# EAGLE design 3-chip H-bridge circuit (EAGLE 5.12)
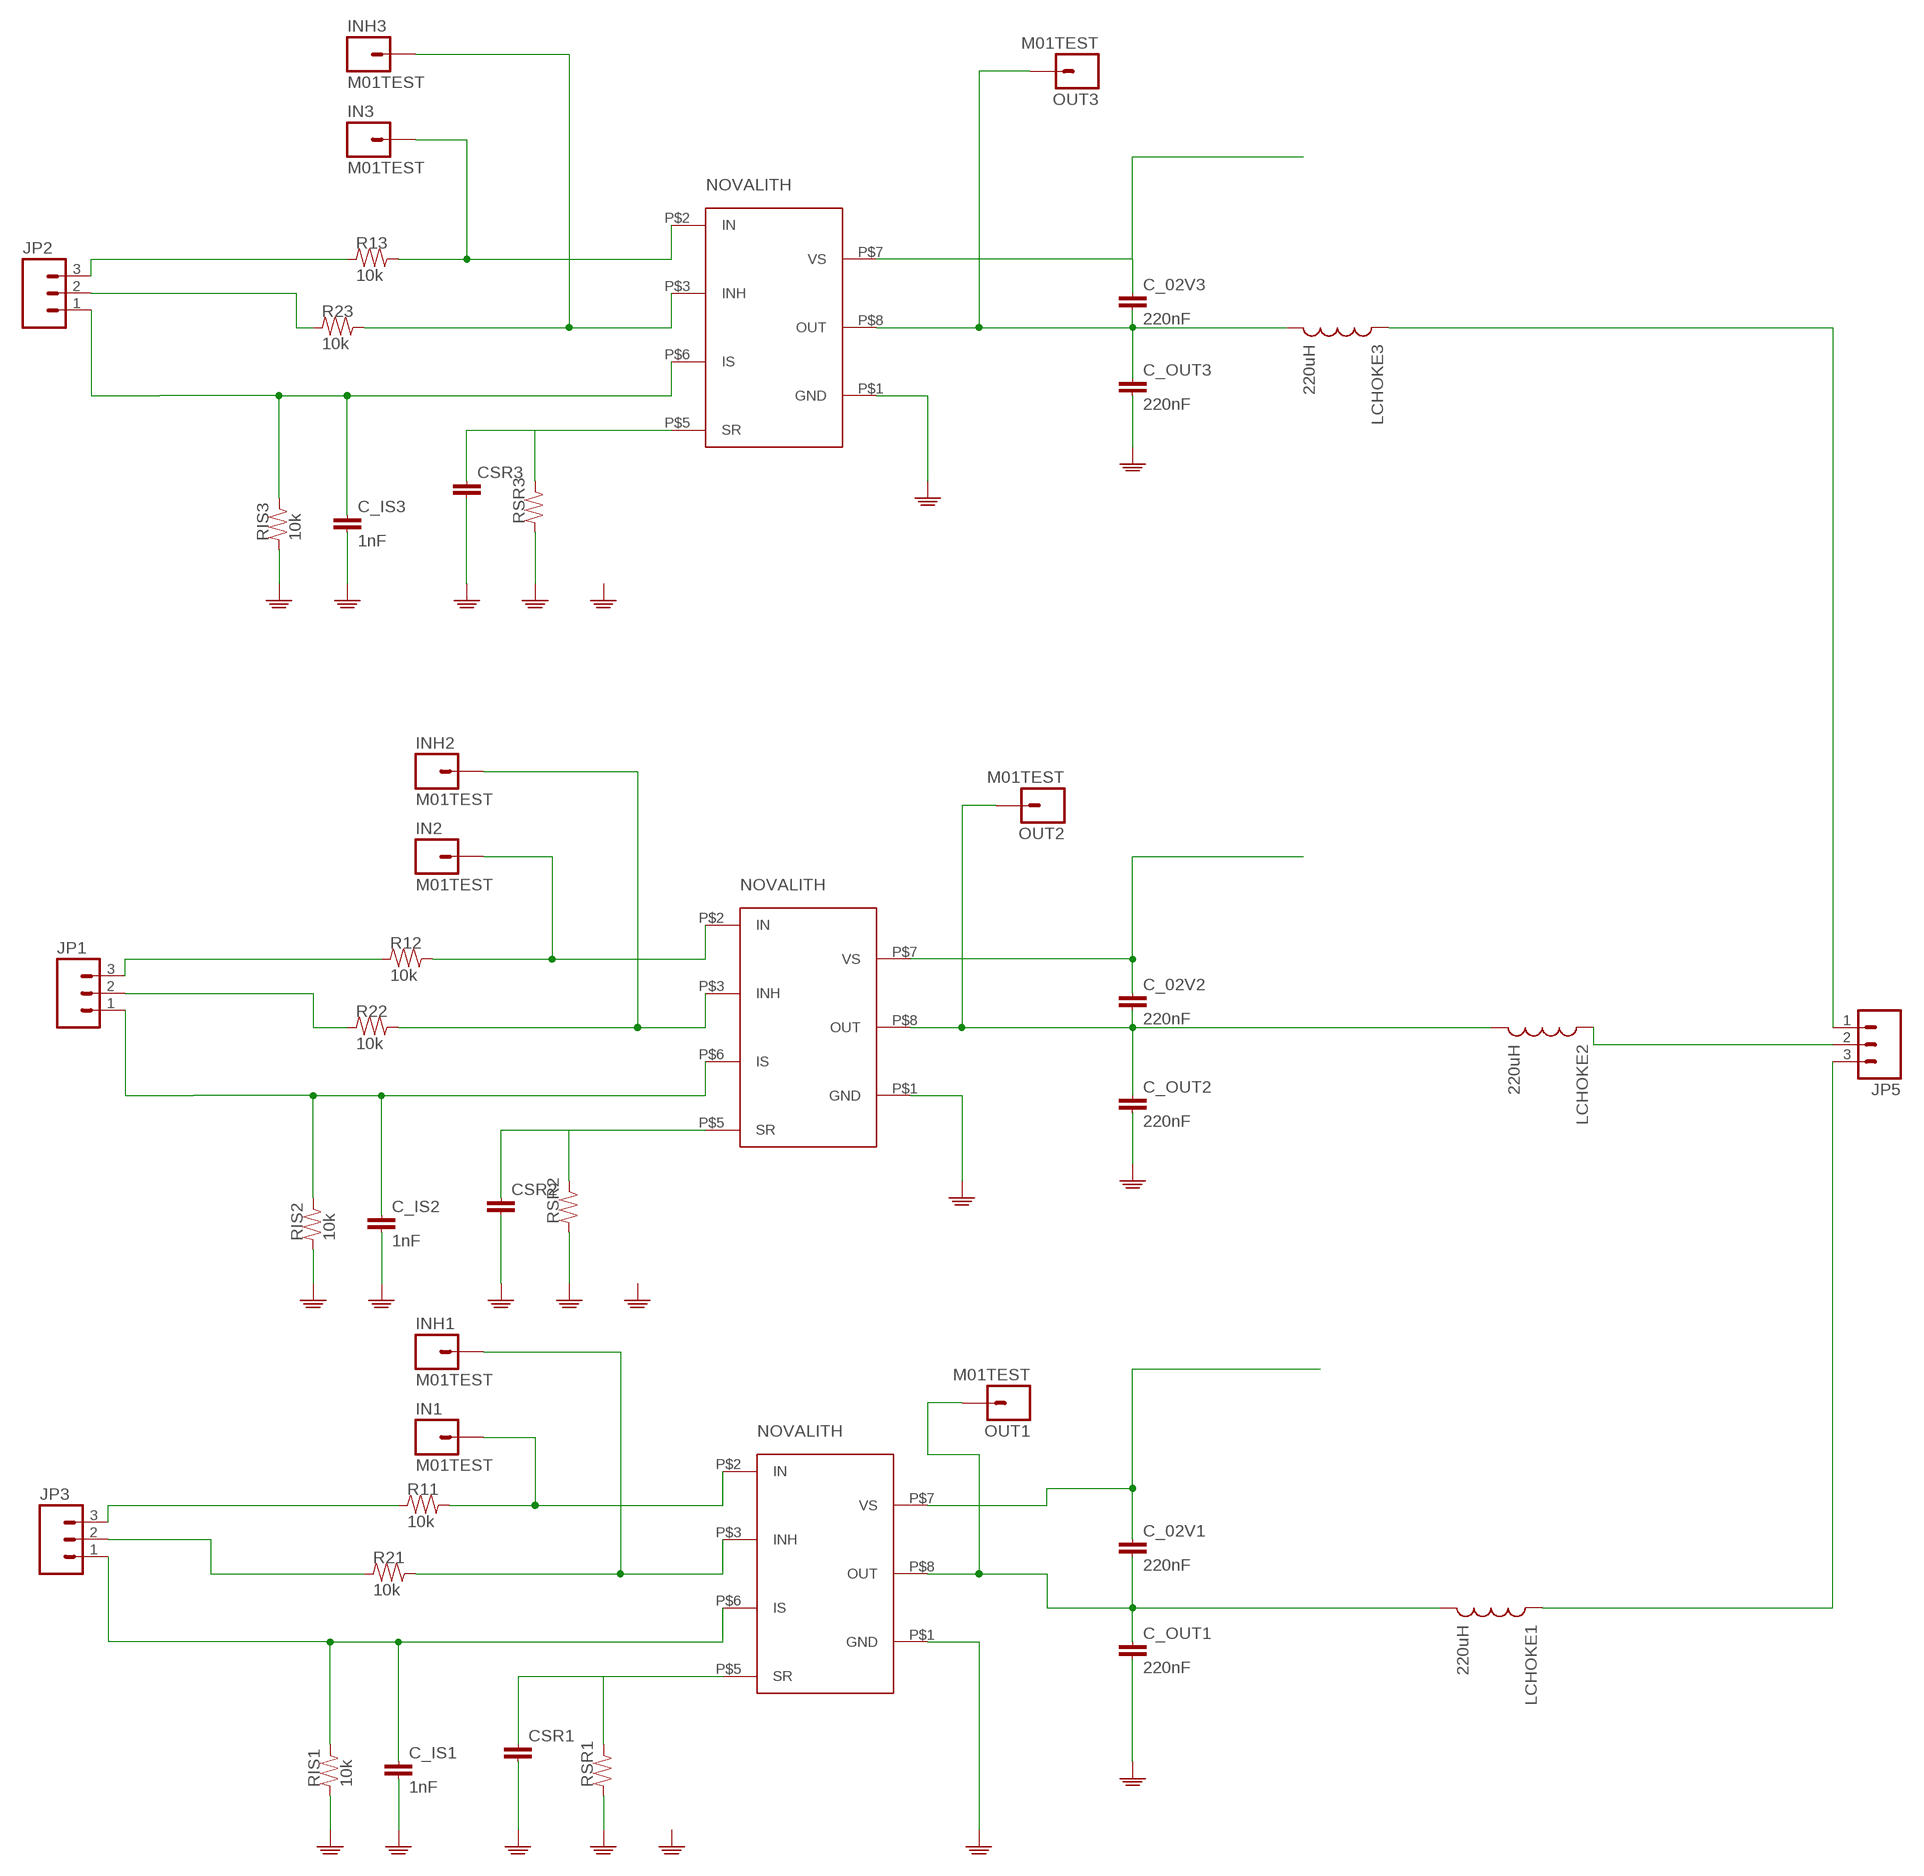
[diagram p0: schematic, sheet 1, part 1 of 2]
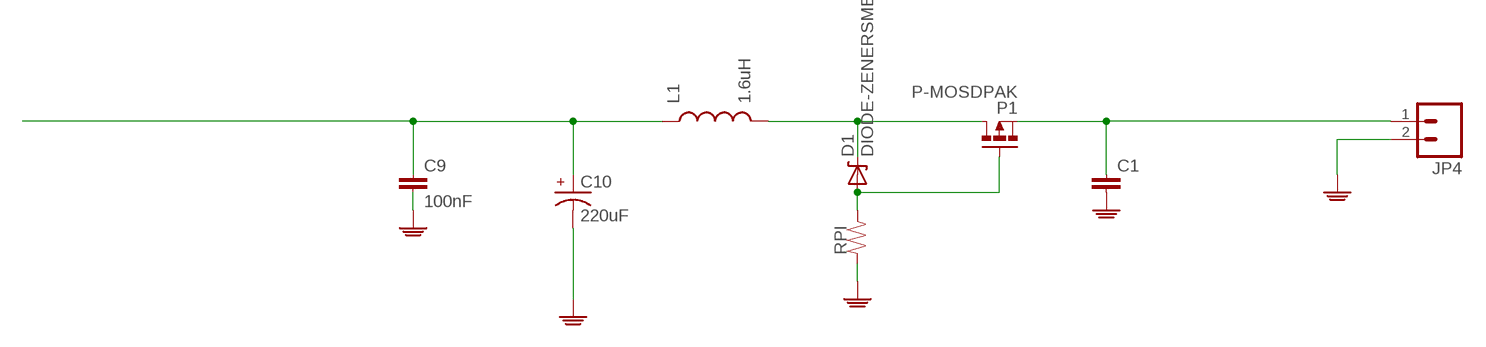
[diagram p1: schematic, sheet 1, part 2 of 2]

## Parts
C1  CAP5MM  [CAP-PTH-5MM]
C9  100nF  CAP1206  [1206]
C10  220uF  CAP-POLPCV10  [PCV10]
C_02V1  220nF  CAP0603  [0603]
C_02V2  220nF  CAP0603  [0603]
C_02V3  220nF  CAP0603  [0603]
C_IS1  1nF  CAP0603  [0603]
C_IS2  1nF  CAP0603  [0603]
C_IS3  1nF  CAP0603  [0603]
C_OUT1  220nF  CAP0603  [0603]
C_OUT2  220nF  CAP0603  [0603]
C_OUT3  220nF  CAP0603  [0603]
CSR1  CAP0603  [0603]
CSR2  CAP0603  [0603]
CSR3  CAP0603  [0603]
D1  DIODE-ZENERSMB  [SMB-DIODE]
IN1  M01TEST  [1X01_TEST]
IN2  M01TEST  [1X01_TEST]
IN3  M01TEST  [1X01_TEST]
INH1  M01TEST  [1X01_TEST]
INH2  M01TEST  [1X01_TEST]
INH3  M01TEST  [1X01_TEST]
JP1  M03PH-TH  [JST-3-PH-TH]
JP2  M03PH-TH  [JST-3-PH-TH]
JP3  M03PH-TH  [JST-3-PH-TH]
JP4  M02MINIFITJR  [MOLEX-2-MINIFITJR-RA]
JP5  M03MINIFITJR  [MOLEX-3-MINIFITJR-RA]
L1  1.6uH  INDUCTOR  [INDETQ-P]
LCHOKE1  220uH  INDUCTOR2200LL-820  [2200LL-820]
LCHOKE2  220uH  INDUCTOR2200LL-820  [2200LL-820]
LCHOKE3  220uH  INDUCTOR2200LL-820  [2200LL-820]
OUT1  M01TEST  [1X01_TEST]
OUT2  M01TEST  [1X01_TEST]
OUT3  M01TEST  [1X01_TEST]
P1  P-MOSDPAK  [DPAK]
R11  10k  R0603  [0603]
R12  10k  R0603  [0603]
R13  10k  R0603  [0603]
R21  10k  R0603  [0603]
R22  10k  R0603  [0603]
R23  10k  R0603  [0603]
RIS1  10k  R0603  [0603]
RIS2  10k  R0603  [0603]
RIS3  10k  R0603  [0603]
RPI  R0603  [0603]
RSR1  R0603  [0603]
RSR2  R0603  [0603]
RSR3  R0603  [0603]
U$2  NOVALITHIC2  [PG-TO263-7-1]
U$3  NOVALITHIC2  [PG-TO263-7-1]
U$4  NOVALITHIC2  [PG-TO263-7-1]

## Nets
GND: C1.2 C9.2 C10.- C_IS1.2 C_IS2.2 C_IS3.2 C_OUT1.2 C_OUT2.2 C_OUT3.2 CSR1.2 CSR2.2 CSR3.2 JP4.2 RIS1.1 RIS2.1 RIS3.1 RPI.1 RSR1.1 RSR2.1 RSR3.1 U$2.P$1(GND) U$3.P$1(GND) U$4.P$1(GND)
N$1: IN1.1 R11.2 U$2.P$2(IN)
N$2: C_IS1.1 JP3.1 RIS1.2 U$2.P$6(IS)
N$3: JP5.2 LCHOKE2.1
N$4: INH1.1 R21.2 U$2.P$3(INH)
N$6: IN3.1 R13.2 U$3.P$2(IN)
N$7: C_02V2.2 C_OUT2.1 LCHOKE2.2 OUT2.1 U$4.P$8(OUT)
N$8: JP3.2 R21.1
N$9: C_IS3.1 JP2.1 RIS3.2 U$3.P$6(IS)
N$10: C_02V1.2 C_OUT1.1 LCHOKE1.2 OUT1.1 U$2.P$8(OUT)
N$11: D1.C L1.P$4 P1.D
N$12: JP3.3 R11.1
N$14: INH3.1 R23.2 U$3.P$3(INH)
N$15: IN2.1 R12.2 U$4.P$2(IN)
N$16: C_IS2.1 JP1.1 RIS2.2 U$4.P$6(IS)
N$18: INH2.1 R22.2 U$4.P$3(INH)
N$19: JP1.2 R22.1
N$20: D1.A P1.G RPI.2
N$21: JP1.3 R12.1
N$22: C_02V3.2 C_OUT3.1 LCHOKE3.2 OUT3.1 U$3.P$8(OUT)
N$23: C1.1 JP4.1 P1.S
N$24: JP2.2 R23.1
N$25: JP2.3 R13.1
N$26: JP5.3 LCHOKE1.1
N$28: JP5.1 LCHOKE3.1
N$29: CSR1.1 RSR1.2 U$2.P$5(SR)
N$30: CSR3.1 RSR3.2 U$3.P$5(SR)
N$31: CSR2.1 RSR2.2 U$4.P$5(SR)
VS: C9.1 C10.+ C_02V1.1 C_02V2.1 C_02V3.1 L1.P$3 U$2.P$7(VS) U$3.P$7(VS)
Unconnected: U$4.P$7(VS)

## Library data of the parts
C1 = GibbotV5SLAM:CAP: Capacitor Standard 0603 ceramic capacitor, and 0.1" leaded capacitor.
C9 C_02V1-C_02V3 C_IS1-C_IS3 C_OUT1-C_OUT3 CSR1-CSR3 = GibbotV5 (1):CAP: Capacitor Standard 0603 ceramic capacitor, and 0.1" leaded capacitor.
C10 = GibbotV5SLAM:CAP-POL: CAPACITOR, American symbol
D1 = GibbotV5 (1):DIODE-ZENER: Zener Diode Production Part - 8199 3.4V Zener Voltage
IN1-IN3 INH1-INH3 OUT1-OUT3 = GibbotV5 (1):M01: Header 1 Standard 1-pin 0.1" header. Use with straight break away headers (SKU : PRT-00116), right angle break away headers (PRT-00553), swiss pins (PRT-00743), machine pins (PRT-00117), and female headers (PRT-00115).
JP1-JP3 JP5 = GibbotV5 (1):M03: Header 3 Standard 3-pin 0.1" header. Use with straight break away headers (SKU : PRT-00116), right angle break away headers (PRT-00553), swiss pins (PRT-00743), machine pins (PRT-00117), and female headers (PRT-00115). Molex polarized connector foot print use with SKU : PRT-08232 with associated crimp pins and housings.
JP4 = GibbotV5 (1):M02: Header 2 Standard 2-pin 0.1" header. Use with straight break away headers (SKU : PRT-00116), right angle break away headers (PRT-00553), swiss pins (PRT-00743), machine pins (PRT-00117), and female headers (PRT-00115). Molex polarized connector foot print use with SKU : PRT-08233 with associated crimp pins and housings.
L1 = GibbotV5SLAM:INDUCTOR: Inductors Basic Inductor/Choke - 0603 and 1206. Footprints are not proven and vary greatly between part numbers.
LCHOKE1-LCHOKE3 = GibbotV5 (1):INDUCTOR: Inductors Basic Inductor/Choke - 0603 and 1206. Footprints are not proven and vary greatly between part numbers.
P1 = GibbotV5SLAM:P-MOSDPAK
R11-R13 R21-R23 RIS1-RIS3 RPI RSR1-RSR3 = GibbotV5 (1):R: RESISTOR, American symbol
U$2-U$4 = SLAM:NOVALITHIC

## Board
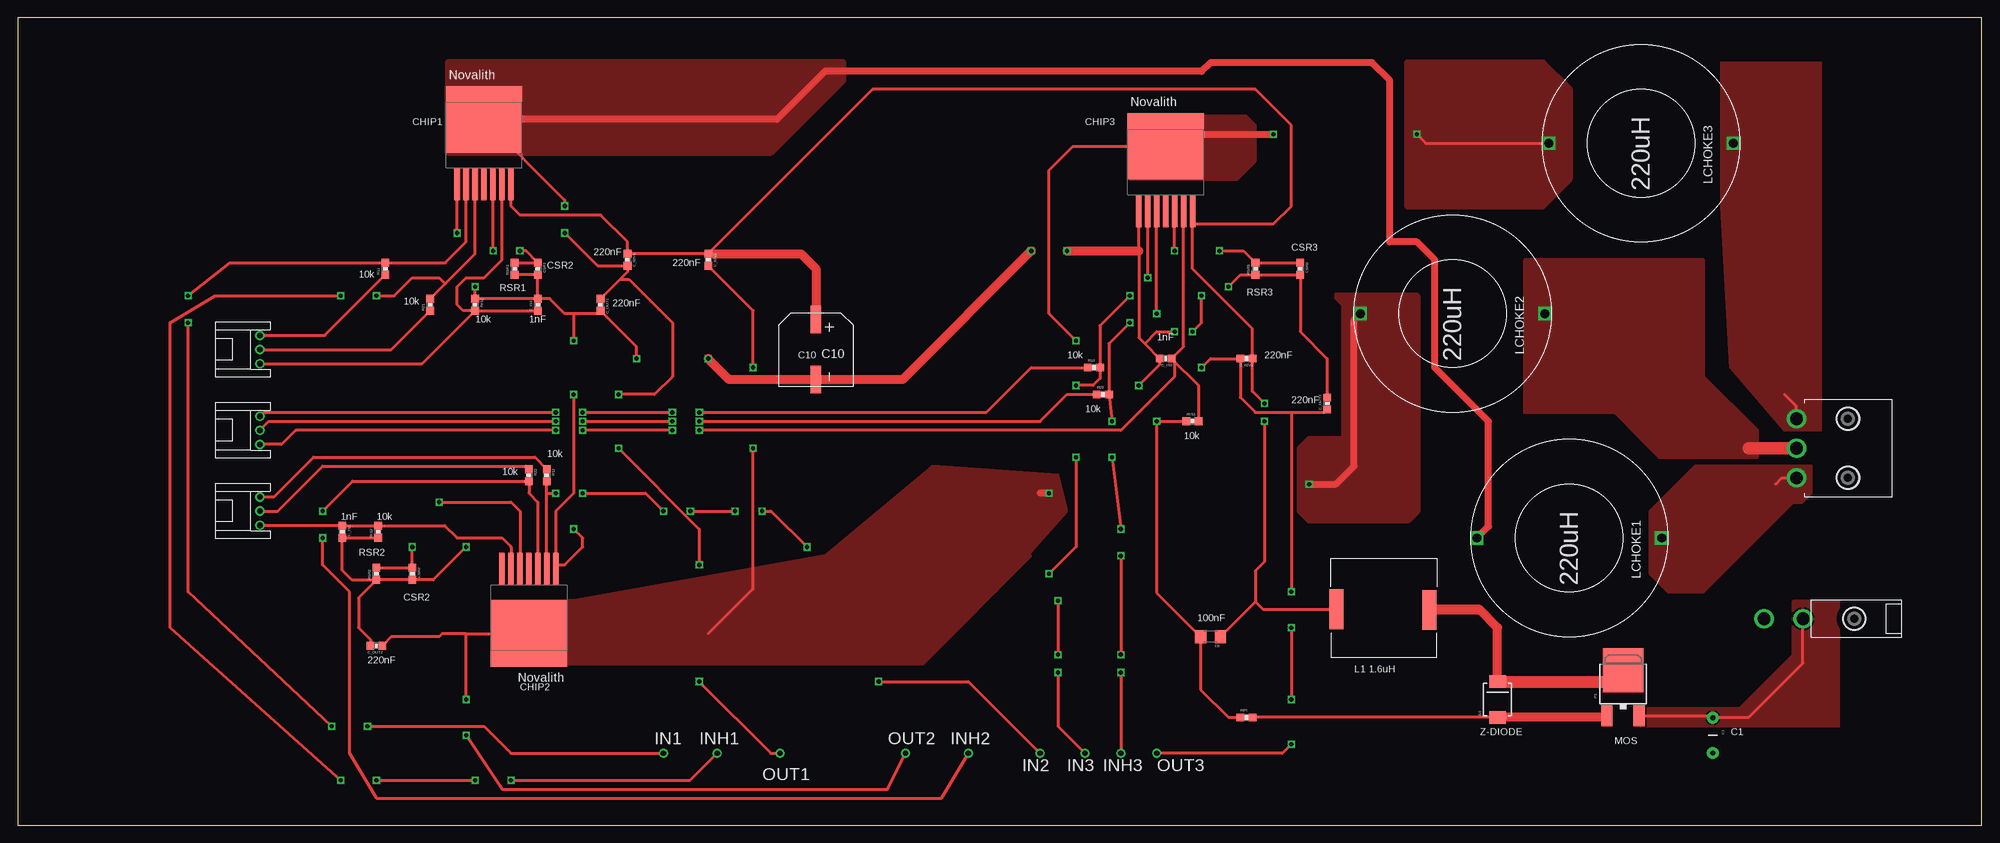
[diagram p2: board, top side]
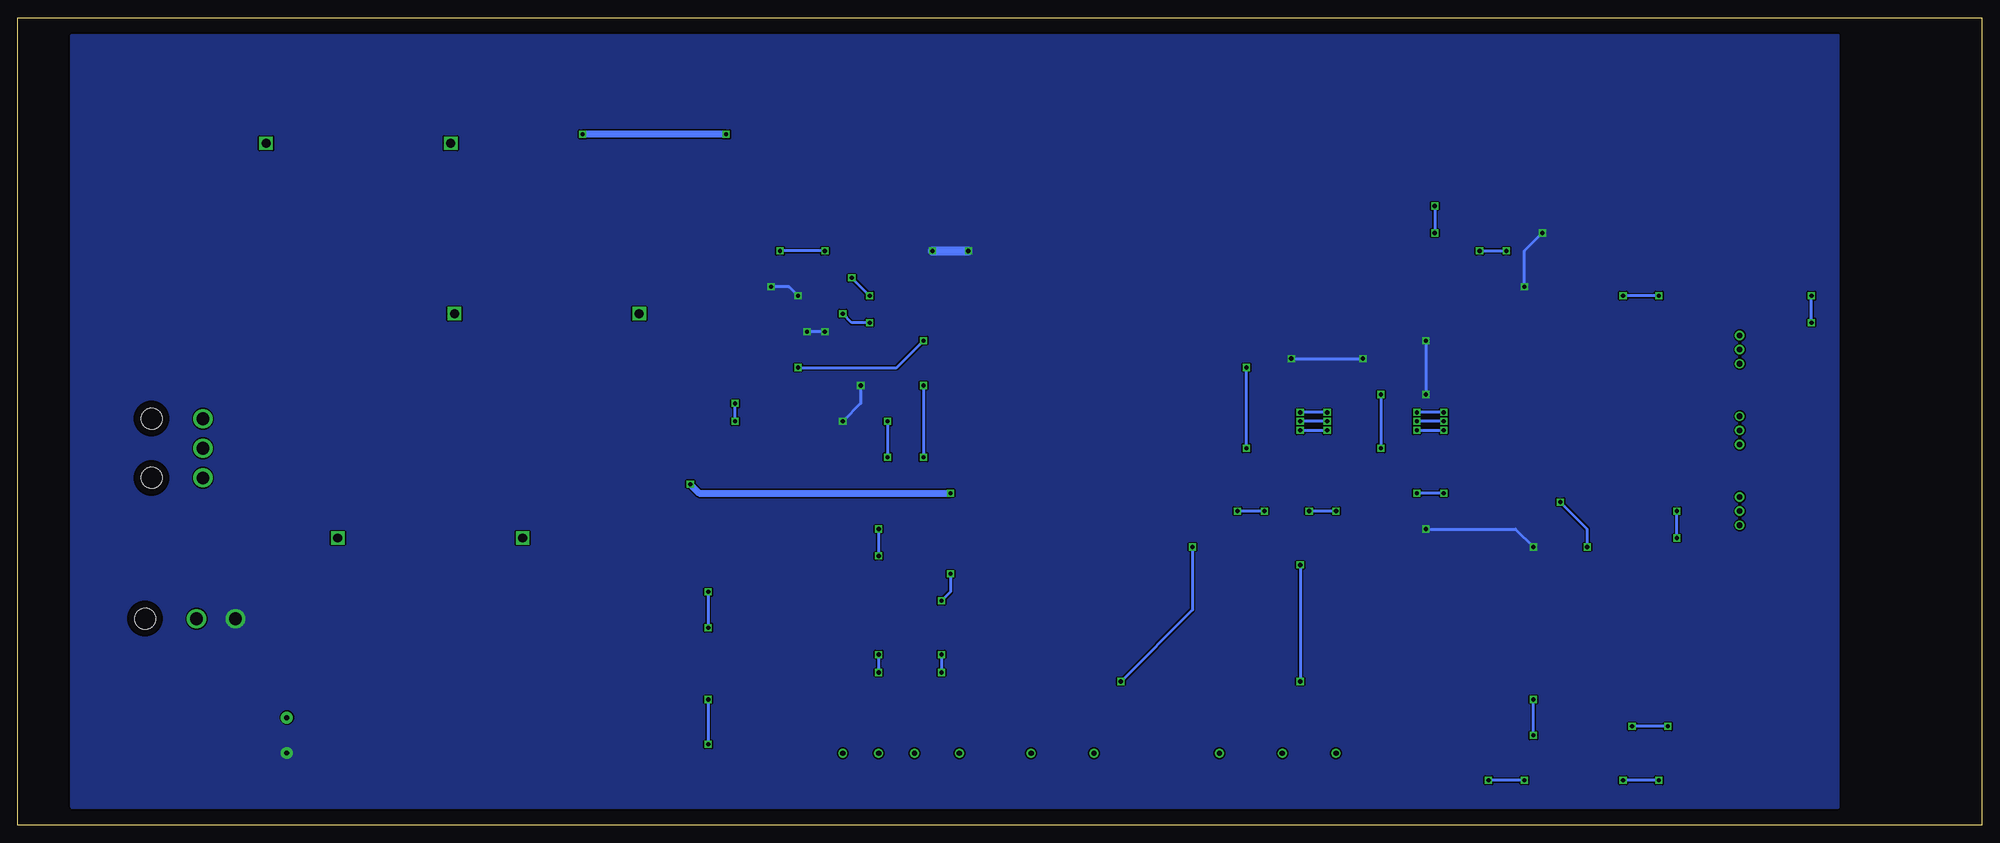
[diagram p3: board, bottom side, seen from below]

Size 278.13 x 114.3 mm. Coordinates in mm from the lower left corner, seen from the top.
Outline: 0,0 278.13,0 278.13,114.3 0,114.3 0,0
Copper layers (1*16): Top 0.035mm / dielectric 1.5mm / Bottom 0.035mm
Design rules "default": minimum track width 10mil, minimum drill 24mil, track to track 8mil, track to pad 8mil, pad to pad 8mil, via to via 8mil, smd to smd 8mil, copper to edge 40mil, drill to drill 8mil, minimum pad ring 10mil, minimum via ring 8mil, stop-mask expansion 4mil, vias tented up to drill 0mil, thermal gap 10mil

### Footprints (pad centres in the part's own frame; a part is rotated, then mirrored left to right if it is on the bottom)
CAP-PTH-5MM = drill 0.7 pad 1.651 round: 1 -2.5,0; 2 2.5,0
1206 = smd 1.6 x 1.8: 1 -1.4,0; 2 1.4,0
PCV10 = smd 1.5 x 3.9: + 0,-4.25; - 0,4.25
0603 = smd 1.1 x 1.1: 1 -0.85,0; 2 0.85,0
SMB-DIODE = smd 1.75 x 2.3: A -2.54,0; C 2.54,0
1X01_TEST = drill 0.762 round: 1 0,0
JST-3-PH-TH = drill 0.8 round: 1 -2,-6.35; 2 0,-6.35; 3 2,-6.35
MOLEX-2-MINIFITJR-RA = drill 1.803 round: 1 0,13.894; 2 0,19.406 | hole 3: 0,6.604
MOLEX-3-MINIFITJR-RA = drill 1.803 round: 1 4.191,13.538; 2 0,13.538; 3 -4.191,13.538 | hole 3: -4.204,6.248; 4.204,6.248
INDETQ-P = smd 2 x 5.6: P$3 -1.215,-1.195; P$4 11.93,-1.3
2200LL-820 = drill 1.27 square: 1 0,13.081; 2 0,-13.081
DPAK = smd 5.791 x 6.274: D 0,1.587 | smd 1.6 x 3: G -2.286,-4.851; S 2.286,-4.851
PG-TO263-7-1 = smd 0.8 x 4.6: P$1 -3.81,-5.775; P$2 -2.54,-5.775; P$3 -1.27,-5.775; P$4 0,-5.775; P$5 1.27,-5.775; P$6 2.54,-5.775; P$7 3.81,-5.775 | smd 10.8 x 9.4: P$8 0,3.38

### Placement (x,y rotation side)
C1  240.03,12.7 270 top
C9  168.91,26.67 180 top
C10  113.03,67.31 180 top
C_02V1  86.36,80.01 270 top
C_02V2  97.79,80.01 270 top
C_02V3  173.99,66.04 180 top
C_IS1  73.66,73.66 90 top
C_IS2  45.97,41.53 270 top
C_IS3  162.56,66.04 180 top
C_OUT1  82.55,73.66 270 top
C_OUT2  50.8,25.4 180 top
C_OUT3  185.42,59.69 90 top
CSR1  73.66,78.74 270 top
CSR2  55.88,35.56 270 top
CSR3  181.61,78.74 270 top
D1  209.55,17.78 90 top
IN1  91.44,10.16 0 top
IN2  144.78,10.16 0 top
IN3  151.13,10.16 0 top
INH1  99.06,10.16 0 top
INH2  134.62,10.16 0 top
INH3  156.21,10.16 0 top
JP1  27.94,44.45 90 top
JP2  27.94,55.88 90 top
JP3  27.94,67.31 90 top
JP4  266.7,29.21 90 top
JP5  265.43,53.34 90 top
L1  187.96,31.75 0 top
LCHOKE1  219.71,40.64 270 top
LCHOKE2  203.2,72.39 270 top
LCHOKE3  229.87,96.52 270 top
OUT1  107.95,10.16 0 top
OUT2  125.73,10.16 0 top
OUT3  161.29,10.16 0 top
P1  227.33,20.32 0 top
R11  52.07,78.74 90 top
R12  74.93,49.53 270 top
R13  152.4,64.77 0 top
R21  58.42,73.66 90 top
R22  72.39,49.53 270 top
R23  153.67,60.96 0 top
RIS1  64.77,73.66 270 top
RIS2  51.05,41.53 90 top
RIS3  166.37,57.15 0 top
RPI  173.99,15.24 0 top
RSR1  70.36,78.74 90 top
RSR2  50.8,35.56 90 top
RSR3  175.26,78.74 90 top
U$2  66.04,96.52 0 top
U$3  162.56,92.71 0 top
U$4  72.39,30.48 180 top

### Tracks (layer width: path | path; a pad name or v marks a point on that pad's centre or on a via)
GND  (via drill 0.6)
  Top 0.406: C_IS1.2 RIS1.1 v64.77,76.2 | C_IS1.2 CSR1.2 RSR1.1 | v62.23,83.82 U$2.P$1 | C_IS1.2 75.35,74.51 77.47,72.39 78.74,72.39 | 78.74,72.39 82.13,72.39 C_OUT1.2 87.63,67.73 v87.63,66.04 | 50.76,34.67 47.37,34.67 45.97,36.07 C_IS2.2 RIS2.1 | 50.76,34.67 RSR2.1 CSR2.2 58.84,34.71 v63.5,39.37 | 76.2,36.83 76.2,44.45 78.74,46.99 v78.74,60.96 | 76.2,36.83 U$4.P$1 | 78.74,72.39 v78.74,68.58 | U$3.P$1 158.75,81.28 158.75,69 159.59,68.16 | C_OUT3.2 185.42,66.04 181.61,69.85 CSR3.2 RSR3.1 173.14,77.89 v171.45,76.2 | v158.75,62.23 161.71,65.19 C_IS3.2 159.59,68.16 | RIS3.1 v161.29,57.15 161.29,32.89 C9.2 167.51,19.18 171.45,15.24 RPI.1 | 50.76,34.67 48.26,32.17 48.26,27.94 49.95,26.25 C_OUT2.2 | v78.74,41.91 80.01,40.64 80.01,39.37 77.47,36.83 76.2,36.83 | v167.64,74.93 167.64,71.12 v166.37,69.85 | v163.83,69.85 161.29,69.85 159.59,68.16
  Top 1.27: v97.79,66.04 100.77,63.06 C10.- 125.29,63.06 v143.51,81.28 | v148.59,81.28 158.75,81.28
  Bottom 0.406: v64.77,76.2 64.77,81.28 v62.23,83.82 | v78.74,68.58 v78.74,60.96 | v158.75,62.23 158.75,59.69 v161.29,57.15 | v97.79,66.04 v87.63,66.04 | v63.5,39.37 66.04,41.91 v78.74,41.91 | v171.45,76.2 168.91,76.2 v167.64,74.93 | v163.83,69.85 v166.37,69.85
  Bottom 1.27: v148.59,81.28 v143.51,81.28
  pour Bottom: 20.32,111.76 270.51,111.76 270.51,2.54 20.32,2.54
  pour Bottom (no thermals): 243.84,31.75 250.19,31.75 250.19,26.67 243.84,26.67
  pour Bottom (no thermals): 237.49,11.43 242.57,11.43 242.57,7.62 237.49,7.62
N$1  (via drill 0.6)
  Top 0.406: U$2.P$2 63.5,82.55 60.54,79.59 R11.2 30.06,79.59 v24.13,74.93 | IN1.1 69.85,10.16 66.04,13.97 v49.53,13.97 | v44.45,13.97 24.13,33.02 v24.13,71.12
  Bottom 0.406: v44.45,13.97 v49.53,13.97 | v24.13,71.12 v24.13,74.93
N$2
  Top 0.406: JP3.1 57.27,65.31 RIS1.2 | RIS1.2 C_IS1.1 | RIS1.2 63.08,72.81 62.23,73.66 62.23,76.2 63.5,77.47 66.04,77.47 68.58,80.01 U$2.P$6
N$3
  Top 1.778: 245.11,53.34 JP5.2
  pour Top (no thermals): 246.38,52.07 246.38,55.88 238.76,63.5 238.76,80.01 213.36,80.01 213.36,58.42 226.06,58.42 232.41,52.07
N$4  (via drill 0.6)
  Top 0.406: 60.53,76.62 R21.2 | 60.53,76.62 64.77,80.86 U$2.P$3 | INH1.1 95.25,6.35 v69.85,6.35 | v50.8,6.35 v64.77,6.35 | v45.72,6.35 21.59,27.94 21.59,71.12 27.94,74.93 v45.72,74.93 | v50.8,74.93 53.34,74.93 55.88,77.47 59.69,77.47 60.53,76.62
  Bottom 0.406: v64.77,6.35 v69.85,6.35 | v45.72,6.35 v50.8,6.35 | v45.72,74.93 v50.8,74.93
N$6  (via drill 0.6)
  Top 0.406: v157.48,74.93 153.25,70.7 R13.2 153.29,64.73 153.29,63.25 152.27,62.23 v149.86,62.23 | v160.02,77.47 U$3.P$2 | IN3.1 147.32,13.97 v147.32,21.59 | v147.32,31.75 v147.32,24.13 | v146.05,35.56 149.86,39.37 v149.86,52.07
  Bottom 0.406: v157.48,74.93 v160.02,77.47 | v147.32,24.13 v147.32,21.59 | v147.32,31.75 146.05,33.02 v146.05,35.56 | v149.86,62.23 v149.86,52.07
N$7  (via drill 0.6)
  Top 0.406: 63.5,27.1 60.12,27.1 59.69,26.67 52.92,26.67 C_OUT2.1 | 63.5,27.1 U$4.P$8 | OUT2.1 123.19,5.08 68.58,5.08 v63.5,12.7 | v63.5,17.78 63.5,27.1 | C_02V2.2 104.14,72.81 v104.14,64.77 | v104.14,53.34 104.14,33.45 97.79,27.1
  Top 1.016: LCHOKE2.2 189.23,71.5 189.23,50.8 186.69,48.26 v182.88,48.26 | v146.05,46.99 144.78,46.99
  Bottom 0.406: v63.5,12.7 v63.5,17.78 | v104.14,53.34 v104.14,64.77
  Bottom 1.016: v182.88,48.26 181.61,46.99 v146.05,46.99
  pour Top (no thermals): 67.31,31.75 67.31,22.86 99.06,22.86 128.27,22.86 143.51,38.1 129.54,50.8 114.3,38.1 78.74,31.75
  pour Top: 125.73,46.99 138.43,33.02 148.59,44.45 147.32,49.53 129.54,50.8
  pour Top (no thermals): 186.69,74.93 198.12,74.93 198.12,44.45 196.85,43.18 182.88,43.18 181.61,44.45 181.61,52.07 181.61,53.34 182.88,54.61 186.69,54.61 187.96,54.61 187.96,73.66
N$8
  Top 0.406: JP3.2 52.92,67.31 R21.1
N$9  (via drill 0.6)
  Top 0.406: C_IS3.1 165.1,67.73 U$3.P$6 | JP2.1 37.37,53.88 39.37,55.88 v76.2,55.88 | C_IS3.1 163.83,65.62 163.83,63.5 156.21,55.88 v96.52,55.88 | RIS3.2 167.22,62.23 C_IS3.1 | v92.71,55.88 v80.01,55.88
  Bottom 0.406: v80.01,55.88 v76.2,55.88 | v96.52,55.88 v92.71,55.88
N$10  (via drill 0.6)
  Top 0.406: 85.3,77.26 C_OUT1.1 | 85.3,77.26 86.36,78.32 C_02V1.2 82.13,79.16 v77.47,83.82 | OUT1.1 106.68,10.16 v96.52,20.32 | v96.52,36.83 96.52,41.91 v85.09,53.34 | v85.09,60.96 90.17,60.96 92.71,63.5 92.71,71.12 86.57,77.26 85.3,77.26 | v77.47,87.63 77.47,88.47 U$2.P$8
  Top 1.016: U$2.P$8 107.52,99.9 114.3,106.68 167.64,106.68 168.91,107.95 191.77,107.95 194.31,105.41 194.31,82.55 198.12,82.55 200.66,80.01 200.66,64.77 208.28,57.15 208.28,42.29 LCHOKE1.2
  Bottom 0.406: v96.52,36.83 v96.52,20.32 | v85.09,60.96 v85.09,53.34 | v77.47,87.63 v77.47,83.82
  pour Top (no thermals): 60.96,104.14 60.96,95.25 106.68,95.25 116.84,105.41 116.84,107.95 60.96,107.95
N$11
  Top 0.406: 225.74,20.32 P1.D
  Top 1.27: 207.04,30.45 209.55,27.94 D1.C
  Top 1.422: 207.04,30.45 L1.P$4
  Top 1.676: D1.C 225.74,20.32
N$12
  Top 0.406: JP3.3 43.49,69.31 R11.1
N$14  (via drill 0.6)
  Top 0.406: v157.48,71.12 154.52,68.16 R23.2 v154.94,57.15 | v161.29,72.39 U$3.P$3 | v156.21,21.59 INH3.1 | v156.21,38.1 v156.21,24.13 | v154.94,52.07 v156.21,41.91
  Bottom 0.406: v157.48,71.12 160.02,71.12 v161.29,72.39 | v156.21,24.13 v156.21,21.59 | v156.21,41.91 v156.21,38.1 | v154.94,57.15 v154.94,52.07
N$15  (via drill 0.6)
  Top 0.406: U$4.P$2 74.93,46.99 | 74.93,46.99 R12.2 | IN2.1 134.62,20.32 v121.92,20.32 | v111.76,39.37 106.68,44.45 v105.41,44.45 | v95.25,44.45 v101.6,44.45 | v91.44,44.45 88.9,46.99 v80.01,46.99 | 74.93,46.99 v76.2,46.99
  Bottom 0.406: v121.92,20.32 111.76,30.48 v111.76,39.37 | v101.6,44.45 v105.41,44.45 | v91.44,44.45 v95.25,44.45 | v76.2,46.99 v80.01,46.99
N$16
  Top 0.406: JP1.1 45.9,42.45 C_IS2.1 RIS2.2 60.49,42.38 62.23,40.64 68.58,40.64 69.85,39.37 U$4.P$6
N$18  (via drill 0.6)
  Top 0.406: U$4.P$3 73.66,45.72 72.39,46.99 R22.2 47.41,48.68 v43.18,44.45 | INH2.1 130.81,3.81 50.8,3.81 46.99,10.16 46.99,33.02 43.18,36.83 v43.18,40.64
  Bottom 0.406: v43.18,40.64 v43.18,44.45
N$19
  Top 0.406: JP1.2 36.83,44.45 43.18,50.8 71.97,50.8 R22.1
N$20
  Top 0.406: D1.A RPI.2 | P1.G 224.81,15.24
  Top 1.27: 224.81,15.24 D1.A
N$21
  Top 0.406: JP1.3 36.29,46.45 41.91,52.07 73.24,52.07 R12.1
N$22  (via drill 0.6)
  Top 0.406: 180.34,58.42 175.26,58.42 173.14,60.54 C_02V3.2 168.91,66.04 v167.64,64.77 | 180.34,58.42 185,58.42 C_OUT3.1 | OUT3.1 179.07,10.16 v180.34,11.43 | v180.34,27.94 v180.34,17.78 | U$3.P$8 149.43,96.09 146.05,92.71 146.05,72.39 v149.86,68.58 | 180.34,58.42 v180.34,33.02 | LCHOKE3.2 199.39,96.52 v198.12,97.79
  Top 1.016: v177.8,97.79 164.26,97.79 U$3.P$8
  Bottom 0.406: v180.34,17.78 v180.34,11.43 | v180.34,33.02 v180.34,27.94 | v149.86,68.58 153.67,64.77 v167.64,64.77
  Bottom 1.016: v177.8,97.79 v198.12,97.79
  pour Top (no thermals): 212.09,107.95 215.9,107.95 219.71,104.14 219.71,91.44 215.9,87.63 196.85,87.63 196.85,106.68 196.85,107.95
  pour Top (no thermals): 157.48,100.33 157.48,91.44 172.72,91.44 175.26,93.98 175.26,99.06 173.99,100.33
N$23
  Top 0.406: P1.S 239.76,15.47 | JP4.1 252.81,22.94 245.11,15.24 240.07,15.24 C1.1
  pour Top: 251.46,31.75 257.81,31.75 257.81,13.97 229.87,13.97 229.87,16.51 243.84,16.51 251.46,24.13
N$24  (via drill 0.6)
  Top 0.406: JP2.2 35.56,57.15 v76.2,57.15 | R23.1 148.59,60.96 144.78,57.15 v96.52,57.15 | v80.01,57.15 v92.71,57.15
  Bottom 0.406: v76.2,57.15 v80.01,57.15 | v92.71,57.15 v96.52,57.15
N$25  (via drill 0.6)
  Top 0.406: JP2.3 34.83,58.42 v76.2,58.42 | v96.52,58.42 137.16,58.42 143.51,64.77 R13.1 | v80.01,58.42 v92.71,58.42
  Bottom 0.406: v76.2,58.42 v80.01,58.42 | v92.71,58.42 v96.52,58.42
N$26
  Top 0.406: JP5.3 249.81,49.15 248.92,48.26
  pour Top (no thermals): 254,50.8 247.65,50.8 237.49,50.8 231.14,44.45 231.14,35.56 233.68,33.02 238.76,33.02 251.46,45.72 252.73,45.72 254,46.99
N$28
  Top 0.406: JP5.1 251.89,59.26 250.19,60.96
  pour Top (no thermals): 250.19,55.88 242.57,64.77 241.3,87.63 241.3,107.95 255.27,107.95 255.27,55.88
N$29  (via drill 0.6)
  Top 0.406: v67.31,81.28 U$2.P$5 | RSR1.2 CSR1.1 71.97,81.28 v71.12,81.28
  Bottom 0.406: v71.12,81.28 v67.31,81.28
N$30  (via drill 0.6)
  Top 0.406: CSR3.1 RSR3.2 173.57,81.28 v170.18,81.28 | v163.83,81.28 U$3.P$5
  Bottom 0.406: v163.83,81.28 v170.18,81.28
N$31  (via drill 0.6)
  Top 0.406: RSR2.2 CSR2.1 v55.88,39.37 | v59.69,45.72 69.85,45.72 71.12,44.45 U$4.P$5
  Bottom 0.406: v55.88,39.37 55.88,41.91 v59.69,45.72
VS  (via drill 0.6)
  Top 0.406: U$2.P$7 69.85,87.63 71.12,86.36 82.55,86.36 86.36,82.55 C_02V1.1 C_02V2.1 121.07,104.14 175.26,104.14 180.34,99.06 180.34,87.63 177.8,85.09 166.37,85.09 | 166.37,85.09 166.37,78.74 174.84,70.27 C_02V3.1 174.84,61.38 v176.53,59.69 | 166.37,85.09 U$3.P$7 | 175.26,31.62 C9.1 | 175.26,31.62 175.26,36 176.53,37.27 v176.53,57.15 | L1.P$3 176.32,30.55 175.26,31.62
  Top 1.27: C_02V2.1 110.91,80.86 113.03,78.74 C10.+
  Bottom 0.406: v176.53,57.15 v176.53,59.69

### Text on the board
tPlace: CHIP1 | CHIP3 | CSR3 | 220nF | 220nF | CSR2 | 10k | RSR1 | RSR3 | 10k | 220nF | 10k | 1nF | 1nF | C10 | 10k | 220nF | 220nF | 10k | 10k | 10k | 10k | 1nF | 10k | RSR2 | CSR2 | 100nF | 220nF | L1 1.6uH | CHIP2 | Z-DIODE | C1 | IN1 | INH1 | OUT2 | INH2 | MOS | IN2 | IN3 | INH3 | OUT3 | OUT1